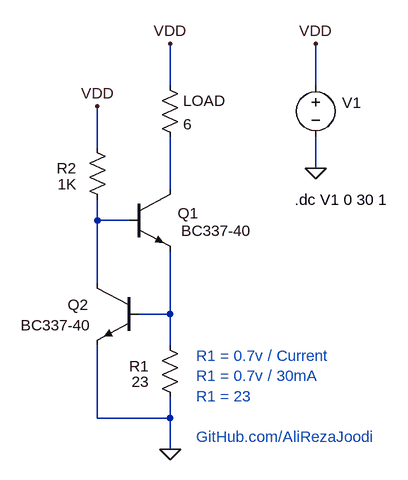
[diagram p0: schematic v1.0.asc]
v1.0.asc, the LTspice schematic file:
Version 4.1
SHEET 1 880 708
WIRE 480 -112 480 -176
WIRE 704 -112 704 -176
WIRE 368 -16 368 -80
WIRE 704 16 704 -32
WIRE 480 48 480 -32
WIRE 368 96 368 64
WIRE 416 96 368 96
WIRE 368 192 368 96
WIRE 480 240 480 144
WIRE 480 240 432 240
WIRE 480 288 480 240
WIRE 368 400 368 288
WIRE 480 400 480 368
WIRE 480 400 368 400
WIRE 480 448 480 400
FLAG 704 16 0
FLAG 480 448 0
FLAG 704 -176 VDD
FLAG 480 -176 VDD
FLAG 368 -80 VDD
SYMBOL voltage 704 -128 M0
WINDOW 0 -70 43 Left 2
WINDOW 3 -69 68 Left 2
WINDOW 123 0 0 Left 0
WINDOW 39 0 0 Left 0
SYMATTR InstName V1
SYMATTR Value ""
SYMBOL res 384 80 R180
WINDOW 0 48 64 Left 2
WINDOW 3 48 40 Left 2
SYMATTR InstName R2
SYMATTR Value 1K
SYMBOL npn 432 192 M0
WINDOW 0 77 34 Left 2
WINDOW 3 73 65 Left 2
SYMATTR InstName Q2
SYMATTR Value BC337-40
SYMBOL res 496 384 R180
WINDOW 0 48 64 Left 2
WINDOW 3 48 40 Left 2
SYMATTR InstName R1
SYMATTR Value 23
SYMBOL res 464 -128 R0
SYMATTR InstName LOAD
SYMATTR Value 6
SYMBOL npn 416 48 R0
WINDOW 0 108 37 Right 2
WINDOW 3 81 64 Left 2
SYMATTR InstName Q1
SYMATTR Value BC337-40
TEXT 520 304 Left 2 ;R1 = 0.7v / Current\nR1 = 0.7v / 30mA\nR1 = 23\n \nGitHub.com/AliRezaJoodi
TEXT 672 64 Left 2 !.dc V1 0 30 1

The netlist it stands for:
* v1.0.asc
V1 VDD 0
R2 N002 VDD 1K
Q2 N002 N003 0 0 BC337-40
R1 0 N003 23
R§LOAD VDD N001 6
Q1 N001 N002 N003 0 BC337-40
.model NPN NPN
.model PNP PNP
.lib standard.bjt
* R1 = 0.7v / Current
* R1 = 0.7v / 30mA
* R1 = 23
* GitHub.com/AliRezaJoodi
.dc V1 0 30 1
.backanno
.end